# Altium schematic sheet Debug.SchDoc
size A; SheetNumber: 5; SheetTotal: 5
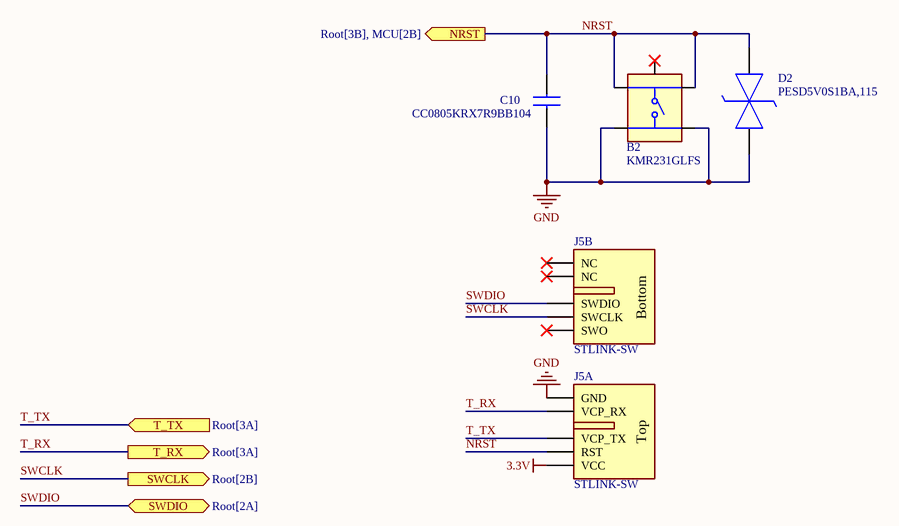
[diagram p0: Debug.SchDoc]

## Parts
B2  KMR231GLFS  [KMR231GLFS]
C10  CC0805KRX7R9BB104  [CAPC2012X95N]
D2  PESD5V0S1BA,115  [SOD2512X110N]
J5  STLINK-SW  [009159010061911]  (parts A,B of 2)  (no BOM)

## Ports
NRST (out, see Root[3B], MCU[2B]), SWCLK (out, see Root[2B]), SWDIO (bidir, see Root[2A]), T_RX (out, see Root[3A]), T_TX (in, see Root[3A])

## Nets
3.3V: J5.5(VCC)
GND: B2.3 B2.4 C10.1 D2.1(K1) J5.1(GND)
NRST: B2.1 B2.2 C10.2 D2.2(K2) J5.4(RST) ; port NRST
SWCLK: J5.9(SWCLK) ; port SWCLK
SWDIO: J5.8(SWDIO) ; port SWDIO
T_RX: J5.2(VCP_RX) ; port T_RX
T_TX: J5.3(VCP_TX) ; port T_TX

Not connected (* = marked no-connect by the designer): B2 5*; J5 6(NC)* 7(NC)* 10(SWO)*

## Notes on the sheet
- (in symbol STLINK-SW, part A) Top
- (in symbol STLINK-SW, part B) Bottom

## Library data of the parts
B2 = KMR231GLFS: Tactile Switch SPST 300gf 1.9mm Gull Wing 4.6mm x 2.8mm Surface Mount; LCSC Part #: C99271; Manu Part #: KMR231GLFS
C10 = CC0805KRX7R9BB104: 100nF, 0805, X7R; Manufacturer_Name: Yageo Group; LCSC Part #: C49678; Manu Part #: CC0805KRX7R9BB104
D2 = PESD5V0S1BA,115: 14VC Clamp 12A@8/20us Ipp ESD DIODE SOD-323; Manu Part #: PESD5V0S1BA,115; LCSC Part #: C19224
J5 = STLINK-SW: SSL Connector 10 Position Adapter, Bridge Board to Board - Card Edge 0.079" (2.00mm)